# Altium project LockSafe.PrjPcb (part 2 of 2)

## Sheet 6V Boost - High Current.SchDoc
size 431 x 279 mm
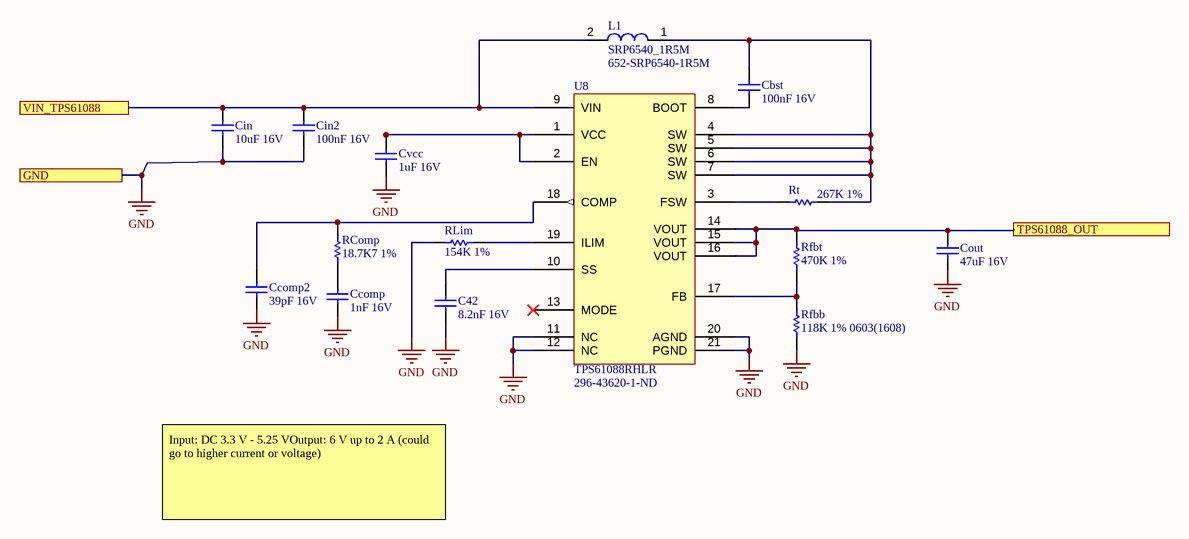
[diagram p10: 6V Boost - High Current.SchDoc]

### Parts
(Parts that share a designator on the sheet are numbered #1, #2 ... from top to bottom, then left to right.)
C42  8.2nF 16V  [CAPC0603(1608)100_M]
Cbst  100nF 16V  [CAPC0603(1608)100_N]
Ccomp  1nF 16V  [CAPC0603(1608)100_L]
Ccomp2  39pF 16V  [CAPC0603(1608)100_L]
Cin2  100nF 16V  [CAPC0603(1608)100_N]
Cin#1  10uF 16V  [CAPC0805(2012)145_N]
Cout#1  47uF 16V  [CAPC2220(5750)300_N]
Cvcc  1uF 16V  [CAPC0603(1608)100_N]
L1#2  SRP6540_1R5M  Supplier Part Number 1: 652-SRP6540-1R5M  [SRP6540_1R5M]
RComp  18.7K7 1%  [RESC0603(1608)_L]
Rfbb  118K 1% 0603(1608)  [RESC0603(1608)_M]
Rfbt  470K 1%  [RESC0603(1608)_L]
RLim  154K 1%  [RESC0603(1608)_L]
Rt  267K 1%  [RESC0603(1608)_L]
U8  TPS61088RHLR  Supplier Part Number 1: 296-43620-1-ND  [QFN50P450X350X100_HS-21N]

### Ports
GND, TPS61088_OUT, VIN_TPS61088

### Nets
GND: C42.1 Ccomp.1 Ccomp2.1 Cin2.1 Cin#1.1 Cout#1.2 Cvcc.1 Rfbb.1 RLim.1 U8.11(NC) U8.12(NC) U8.20(AGND) U8.21(PGND) ; port GND
TPS61088_OUT: Cout#1.1 Rfbt.2 U8.14(VOUT) U8.15(VOUT) U8.16(VOUT) ; port TPS61088_OUT
VIN_TPS61088: Cin2.2 Cin#1.2 L1#2.2 U8.9(VIN) ; port VIN_TPS61088
NetC42_2: C42.2 U8.10(SS)
NetCbst_1: Cbst.1 U8.8(BOOT)
NetCbst_2: Cbst.2 L1#2.1 Rt.1 U8.4(SW) U8.5(SW) U8.6(SW) U8.7(SW)
NetCcomp2_2: Ccomp2.2 RComp.2 U8.18(COMP)
NetCcomp_2: Ccomp.2 RComp.1
NetCvcc_2: Cvcc.2 U8.1(VCC) U8.2(EN)
NetRfbb_2: Rfbb.2 Rfbt.1 U8.17(FB)
NetRLim_2: RLim.2 U8.19(ILIM)
NetRt_2: Rt.2 U8.3(FSW)

Not connected (* = marked no-connect by the designer): U8 13(MODE)*

### Notes on the sheet
- Input: DC 3.3 V - 5.25 VOutput: 6 V up to 2 A (could go to higher current or voltage)
- DWG. NO.
- REV.
- SHT.
- THIS DOCUMENT AND THE DATA DISCLOSED HEREIN OR HEREWITH IS THE PROPERTY OF ALTIUM LIMITED AND MAY BE FREELY DISTRIBUTED IN WHOLE. NO RIGHTS ARE RESERVED OR EXPRESS OR IMPLIED WARANTEE GIVEN.
- REVISION
- DESCRIPTION
- DATE
- APPROVED
- ENG:
- APPROVALS
- PROJECT
- DSN:
- CHK:
- REFERENCE DOCUMENTS
- PROJECT REVISION:
- TITLE
- DOCUMENT REVISION:
- DESIGN ITEM:
- BOM:
- FAB DWG:
- PCB DWG:
- ASSY DWG:
- SCALE:
- SIZE
- B
- CAGE CODE
- FILE NAME
- DWG NO.
- SHEET
- OF
- REV

### Library data of the parts
C42 = CMP-1035-02284-1: CAP 8.2nF 16V ±5% 0603 (1608 Metric) Thickness 1mm SMD; Case-Metric: 1608; Tolerance: Â±5%; Case-EIA: 0603; Rated Voltage: 16 V; Max Thickness: 1 mm; Value: 8.2nF; Technology: SMT
Cbst Cin2 = CMP-1035-02584-1: CAP 100nF 16V ±10% 0603 (1608 Metric) Thickness 1mm SMD; Tolerance: Â±10%; Case-EIA: 0603; Case-Metric: 1608; Technology: SMT; Max Thickness: 1 mm; Value: 100nF; Rated Voltage: 16 V
Ccomp = CMP-1035-01876-1: CAP 1nF 16V ±1% 0603 (1608 Metric) Thickness 1mm SMD; Case-EIA: 0603; Case-Metric: 1608; Tolerance: Â±1%; Value: 1nF; Technology: SMT; Rated Voltage: 16 V; Max Thickness: 1 mm
Ccomp2 = CMP-1035-01085-1: CAP 51pF 16V ±5% 0603 (1608 Metric) Thickness 1mm SMD; Tolerance: Â±5%; Case-EIA: 0603; Case-Metric: 1608; Rated Voltage: 16 V; Value: 51pF; Technology: SMT; Max Thickness: 1 mm
Cin#1 = CMP-1036-04927-1: CAP 10uF 16V ±10% 0805 (2012 Metric) Thickness 1.45mm SMD; Case-EIA: 0805; Tolerance: Â±10%; Case-Metric: 2012; Rated Voltage: 16 V; Technology: SMT; Value: 10uF; Max Thickness: 1.45 mm
Cout#1 = CMP-1042-00776-1: CAP 22uF 16V ±20% 2220 (5750 Metric) Thickness 3mm SMD; Case-Metric: 5750; Case-EIA: 2220; Tolerance: Â±20%; Max Thickness: 3 mm; Value: 22uF; Rated Voltage: 16 V; Technology: SMT
Cvcc = CMP-1035-02736-1: CAP 1uF 16V ±5% 0603 (1608 Metric) Thickness 1mm SMD; Case-Metric: 1608; Case-EIA: 0603; Tolerance: Â±5%; Technology: SMT; Max Thickness: 1 mm; Rated Voltage: 16 V; Value: 1uF
L1#2 = CMP-00369-1: 1.5µH Shielded Wirewound Inductor 11A 10 mOhm Max Nonstandard; Manufacturer: Bourns; Manufacturer Part Number: SRP6540-1R5M; SVHC: No SVHC (16-Dec-2013); Product Range: BOURNS - SRP6540 Series; Inductance Tolerance: ± 20%; DC Resistance Max: 0.01ohm; Supplier 1: Mouser; Stock 1: 1156; Pricing 1: 1=1.18, 10=1.04, 50=0.888, 100=0.843, 1000=0.68, 10000=0.492 (USD); Saturation Current (Isat): 11A; Case Dimensions: 7.2mm x 6.5mm x 4mm; Inductance: 1.5µH; Inductor Construction: Shielded; RMS Current (Irms): 11A; Packaging: Each; ComponentLink1URL: https://datasheet.ciiva.com/15027/srp6540-15027285.pdf; ComponentLink1Description: https://datasheet.ciiva.com/15027/srp6540-15027285.pdf; ComponentLink2URL: https://datasheet.ciiva.com/15027/srp6540-15027286.pdf; ComponentLink2Description: https://datasheet.ciiva.com/15027/srp6540-15027286.pdf; ComponentLink3URL: https://datasheet.ciiva.com/15027/srp6540-15027287.pdf; ComponentLink3Description: https://datasheet.ciiva.com/15027/srp6540-15027287.pdf; ComponentLink4URL: https://datasheet.ciiva.com/22667/1698468-22667146.pdf; ComponentLink4Description: https://datasheet.ciiva.com/22667/1698468-22667146.pdf; ComponentLink5URL: https://datasheet.ciiva.com/17000/70281705-17000734.pdf; ComponentLink5Description: https://datasheet.ciiva.com/17000/70281705-17000734.pdf; ComponentLink6URL: https://datasheet.ciiva.com/28679/1698468-28679550.pdf; ComponentLink6Description: https://datasheet.ciiva.com/28679/1698468-28679550.pdf; SchLibComponentName: SRP6540_1R5M
RComp = CMP-1012-00673-1: 28K7 0.1W 1% 0603 (1608 Metric)  SMD; Case-EIA: 0603; Case-Metric: 1608; Value: 28700.00 Ohm; Tolerance: 1 %; Power: 0.1 W; Technology: SMT
Rfbb = CMP-1012-00743-1: 118K 0.1W 1% 0603 (1608 Metric)  SMD; Case-Metric: 1608; Case-EIA: 0603; Value: 118000.00 Ohm; Technology: SMT; Power: 0.1 W; Tolerance: 1 %
Rfbt = CMP-1012-00812-1: 470K 0.1W 1% 0603 (1608 Metric)  SMD; Value: 470000.00 Ohm; Case-EIA: 0603; Case-Metric: 1608; Power: 0.1 W; Tolerance: 1 %; Technology: SMT
RLim = CMP-1012-00738-1: 105K 0.1W 1% 0603 (1608 Metric)  SMD; Value: 105000.00 Ohm; Case-Metric: 1608; Case-EIA: 0603; Tolerance: 1 %; Technology: SMT; Power: 0.1 W
Rt = CMP-1012-00782-1: 267K 0.1W 1% 0603 (1608 Metric)  SMD; Case-Metric: 1608; Case-EIA: 0603; Value: 267000.00 Ohm; Tolerance: 1 %; Technology: SMT; Power: 0.1 W
U8 = CMP-00368-3: Manufacturer: Texas Instruments; Function: Step-Up; Output Configuration: Positive; Topology: Boost; Output Type: Adjustable; Number of Outputs: 1; Voltage - Input (Min): 2.7V; Voltage - Input (Max): 12V; Voltage - Output (Min/Fixed): 4.5V; Voltage - Output (Max): 12.6V; Current - Output: 10A; Frequency - Switching: 200kHz ~ 2.2MHz; Synchronous Rectifier: Yes; SchLibComponentName: Component_1; Supplier 1: Digi-Key; Manufacturer Part Number: TPS61088RHLR; RoHS: RoHS Compliant; Category: Integrated Circuits (ICs); Stock 1: 3052; Pricing 1: 1=3.93, 10=3.53, 100=2.8922, 500=2.46212, 1000=2.07648 (USD); Packaging: Cut Tape (CT); Part Status: Active; Operating Temperature: -40°C ~ 85°C (TA); Mounting Type: Surface Mount; Package / Case: 20-VFQFN Exposed Pad; Supplier Device Package: 20-VQFN (3.5x4.5); ComponentLink1URL: http://www.ti.com/lit/ds/symlink/tps61088.pdf; ComponentLink1Description: http://www.ti.com/lit/ds/symlink/tps61088.pdf

## Sheet Microphone.SchDoc
size A
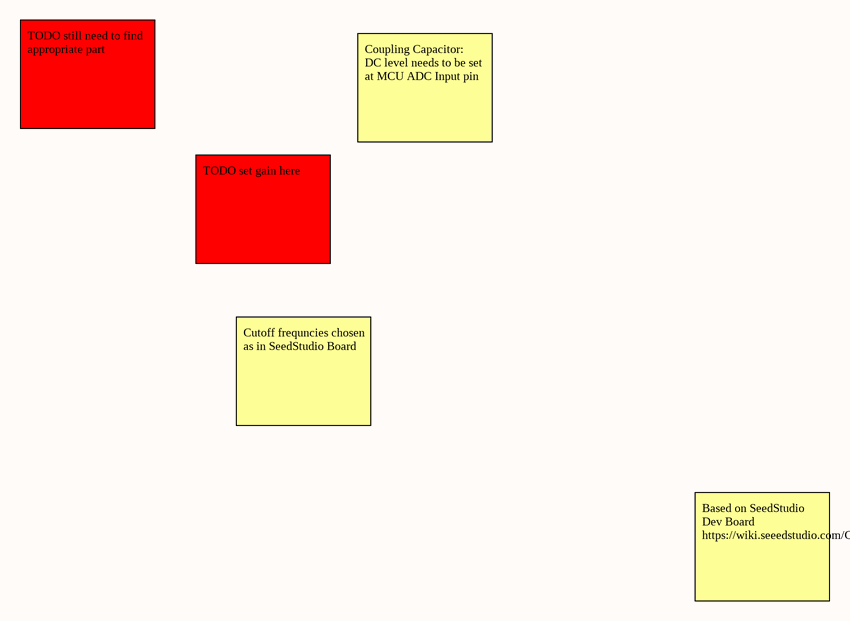
[diagram p11: Microphone.SchDoc]

### Notes on the sheet
- TODO still need to find appropriate part
- Coupling Capacitor:
  DC level needs to be set at MCU ADC Input pin
- TODO set gain here
- Cutoff frequncies chosen as in SeedStudio Board
- Based on SeedStudio Dev Board https://wiki.seeedstudio.com/Grove-Analog-Microphone/

## Sheet Buck6Vto3.3V.SchDoc
size A
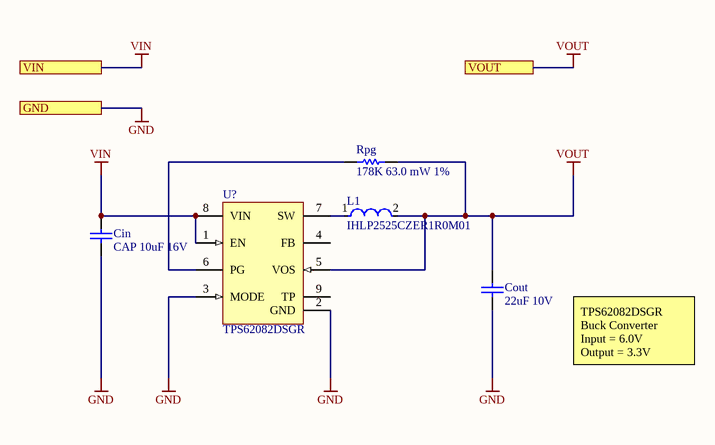
[diagram p12: Buck6Vto3.3V.SchDoc]

### Parts
(Parts that share a designator on the sheet are numbered #1, #2 ... from top to bottom, then left to right.)
Cin#2  CAP 10uF 16V  [CAPC0805(2012)145_N]
Cout#2  22uF 10V  [CAPC0805(2012)145_N]
L1#3  IHLP2525CZER1R0M01  [FP-IHLP-2525CZ-FP_2_413x3-MFG]
Rpg  178K 63.0 mW 1%  [RESC0603(1608)_N]
U?  TPS62082DSGR  [DSG8-1600X900TP]

### Ports
GND, VIN, VOUT

### Nets
GND: Cin#2.1 Cout#2.1 U?.2(GND) U?.3(MODE) ; port GND
VIN: Cin#2.2 U?.1(EN) U?.8(VIN) ; port VIN
VOUT: Cout#2.2 L1#3.2 Rpg.2 U?.5(VOS) ; port VOUT
NetL1#3_1: L1#3.1 U?.7(SW)
NetRpg_1: Rpg.1 U?.6(PG)

Not connected (* = marked no-connect by the designer): U? 4(FB) 9(TP)

### Notes on the sheet
- TPS62082DSGR
  Buck Converter
  Input = 6.0V
  Output = 3.3V

### Library data of the parts
Cin#2 = CMP-1036-04927-1: CAP 10uF 16V ±10% 0805 (2012 Metric) Thickness 1.45mm SMD; Manufacturer: Kyocera AVX; Manufacturer Part Number: 0805YD106KAT2A; Manufacturer: KEMET; Manufacturer Part Number: C0805C106K4PACTU; Manufacturer: TDK; Manufacturer Part Number: C2012X5R1C106K/0.85; Manufacturer Part Number: C2012X6S1C106K; Manufacturer Part Number: C0805C106K4PAC; Manufacturer Part Number: 0805YD106KAT4A; Manufacturer Part Number: C2012X5R1C106K/1.25; Case-EIA: 0805; Tolerance: Â±10%; Case-Metric: 2012; Rated Voltage: 16 V; Technology: SMT; Value: 10uF; Max Thickness: 1.45 mm
Cout#2 = CMP-1036-04943-1: CAP 22uF 10V ±20% 0805 (2012 Metric) Thickness 1.45mm SMD; Manufacturer: TDK; Manufacturer Part Number: C2012X5R1A226M/0.85; Manufacturer Part Number: C2012X5R1A226M/1.25; Manufacturer Part Number: C2012X6S1A226M; Case-Metric: 2012; Case-EIA: 0805; Tolerance: Â±20%; Rated Voltage: 10 V; Max Thickness: 1.45 mm; Technology: SMT; Value: 22uF
L1#3 = CMP-02424-000599-1: Commercial Inductors, High Saturation Series 1uH 11A 10mΩ 20%; Self Resonant Frequency: 5MHz; Test Frequency: 100kHz; Shielding: Shielded; Core Material: Metal; Saturation Current: 22A; DC Resistance (DCR): 10mR; Current Rating: 11A; Packaging: Tape and Reel; Width: 6.47mm; Number of Pins: 2; Case/Package: 2525; Termination: SMD/SMT; Length: 7.24mm; Height: 3mm; Min Operating Temperature: -55°C; Mount: Surface Mount; Inductance Tolerance: 20%; Max Operating Temperature: 125°C; Military Standard: Not; Max DC Current: 11A; RMS Current (Irms): 11A; Lead Free: Lead Free; Depth: 6.72mm; Tolerance: 20%; Package Quantity: 2000; Radiation Hardening: No; Contact Plating: Tin; Inductance: 1uH
Rpg = CMP-1012-00756-1: 178K  1% 0603 (1608 Metric)  SMD; Manufacturer: Panasonic; Manufacturer Part Number: ERJ-3EKF1583V; Manufacturer: Bourns; Manufacturer Part Number: CR0603-FX-1583ELF; Manufacturer: Vishay Dale; Manufacturer Part Number: CRCW0603158KFKEB; Manufacturer: Yageo; Manufacturer Part Number: RC0603FR-07158KL; Manufacturer: Vishay; Manufacturer Part Number: CRCW0603158KFKEA; Manufacturer Part Number: CRCW0603158KFKTA; Power: 0.1 W; Value: 158000.00 Ohm; Case-Metric: 1608; Case-EIA: 0603; Tolerance: 1 %; Technology: SMT
U? = CMP-0323-00344-2: Buck Step Down Regulator with 2.3 to 6 V Input and 3.3 V Output, -40 to 85 degC, 8-Pin WSON (DSG), Green (RoHS & no Sb/Br); Manufacturer: Texas Instruments; Duty Cycle(Max)(%): 100; Iq(Typ)(mA): 0.006; Rating: Catalog; Regulated Outputs(#): 1; Vout(Min)(V): 3.3; SubFamily: Step-Down Regulator; Vin(Max)(V): 6; Iout(Max)(A): 1.2; Vin(Min)(V): 2.3; Switch Current Limit(Typ)(A): 2.4; ComponentLink1Description: Datasheet; PackageReference: DSG8-1600X900TP; ComponentLink2Description: Package Specification; PackageDescription: 8-Pin Plastic Small Outline No-Lead, 2 x 2 x 0.8 mm Body, 0.5 mm Pitch, Exposed Pad; DatasheetVersion: SLVSAE8B; PackageVersion: revB, Oct-2010; Eco-Plan: Green (RoHS & no Sb/Br); Code_JEDEC: MO-229; PartNumber: TPS62082DSGR; ComponentLink1URL: http://www.ti.com/general/docs/lit/getliterature.tsp?genericPartNumber=TPS62082&fileType=pdf; ComponentLink2URL: http://www.ti.com/litv/pdf/mpds308a; ComponentLink3URL: Samples URL:http://www.ti.com/product/tps62082#samples; Mounting Technology: Surface Mount; Vout(Max)(V): 3.3; ComponentLink3Description: URL Link1; Topology: Buck

## Sheet LEDdriver3954.SchDoc
size A
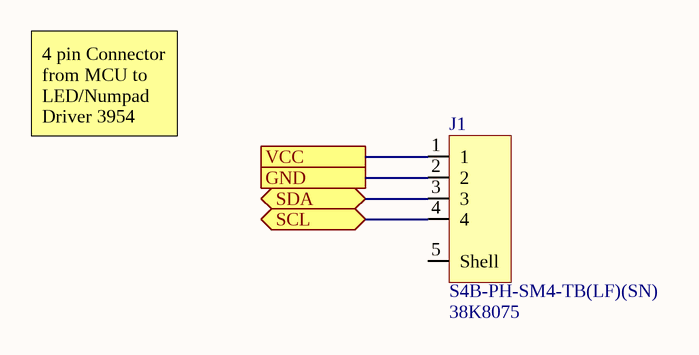
[diagram p13: LEDdriver3954.SchDoc]

### Parts
(Parts that share a designator on the sheet are numbered #1, #2 ... from top to bottom, then left to right.)
J1#2  S4B-PH-SM4-TB(LF)(SN)  Supplier Part Number 1: 38K8075  [S4B-PH-SM4-TB(LF)(SN)]

### Ports
GND, SCL (bidir), SDA (bidir), VCC

### Nets
GND: J1#2.2 ; port GND
SCL: J1#2.4 ; port SCL
SDA: J1#2.3 ; port SDA
VCC: J1#2.1 ; port VCC

Not connected (* = marked no-connect by the designer): J1#2 5(Shell)

### Notes on the sheet
- 4 pin Connector from MCU to LED/Numpad Driver 3954

### Library data of the parts
J1#2 = S4B-PH-SM4-TB(LF)(SN): JST (JAPAN SOLDERLESS TERMINALS) - S4B-PH-SM4-TB(LF)(SN) - Wire-To-Board Connector, 2 mm, 4 Contacts, Header, PH Series, Surface Mount, 1 Rows; Number of Positions: 4; Insulation Resistance: 1GR; Gender: Male; Current Rating: 2A; Voltage Rating: 100V; Connector Type: Header,Male Pin; Contact Resistance: 20mR; Pitch: 2mm; Supplier 1: Newark; Manufacturer: JST; Manufacturer Part Number: S4B-PH-SM4-TB(LF)(SN); RoHS: Yes; Category: Connectors; Mount: Surface Mount; Housing Material: Polyamide; Color: Natural,White; Contact Material: Copper Alloy,Tin,Bronze,Brass; Contact Plating: Tin,Copper; Housing Color: Beige; Contact Shape: Square; Insulation Material: Nylon; Insulation Color: Natural; Min Operating Temperature: -25°C; Max Operating Temperature: 85°C; Termination: Solder; Number of Contacts: 4; Number of Rows: 1; Packaging: Tape and Reel; Voltage Rating (AC): 100V; Orientation: Right Angle; Fastening Type: Detent; Working Voltage: 100V; Max Voltage Rating (AC): 100V; Max Voltage Rating (DC): 100V; Number of Poles: 4; Max Current Rating: 2A; Length: 11.9mm; Width: 5mm; Height: 9.4mm; Contact Mating Length: 0.13inch; Depth: 7.6mm; Lead Pitch: 2mm; Lead Free: Lead Free; REACH SVHC: No SVHC; Flammability Rating: UL94 V-0; ComponentLink1URL: https://datasheet.ciiva.com/11746/0900766b80df0d9d-11746552.pdf?src-supplier=RSComponents; ComponentLink1Description: https://datasheet.ciiva.com/11746/0900766b80df0d9d-11746552.pdf?src-supplier=RSComponents; ComponentLink2URL: https://datasheet.ciiva.com/712/eph-712578.pdf?src-supplier=Digi-Key; ComponentLink2Description: https://datasheet.ciiva.com/712/eph-712578.pdf?src-supplier=Digi-Key; ComponentLink3URL: https://datasheet.ciiva.com/712/eph-712579.pdf?src-supplier=Digi-Key; ComponentLink3Description: https://datasheet.ciiva.com/712/eph-712579.pdf?src-supplier=Digi-Key; ComponentLink4URL: https://datasheet.ciiva.com/730/eph-730675.pdf?src-supplier=Digi-Key; ComponentLink4Description: https://datasheet.ciiva.com/730/eph-730675.pdf?src-supplier=Digi-Key; ComponentLink5URL: https://datasheet.ciiva.com/8052/1699381-8052234.pdf?src-supplier=Element14; ComponentLink5Description: https://datasheet.ciiva.com/8052/1699381-8052234.pdf?src-supplier=Element14; ComponentLink6URL: https://datasheet.ciiva.com/26894/getdatasheetpartid-639990-26894620.pdf?src-supplier=Verical; ComponentLink6Description: https://datasheet.ciiva.com/26894/getdatasheetpartid-639990-26894620.pdf?src-supplier=Verical; ComponentLink7URL: https://datasheet.ciiva.com/16376/eph-16376783.pdf?src-supplier=Future+Electronics; ComponentLink7Description: https://datasheet.ciiva.com/16376/eph-16376783.pdf?src-supplier=Future+Electronics

## Nets that join several sheets
3V3: MAIN (6 pins), MCU (7 pins), Speaker (R35.1), Temperature (R41.1 TP27.1), Accelerometer (R40.1 TP26.1 U10.4 U10.5), Light (R42.1 TP34.1)
6V: MAIN (R22.2), Servo (R39.1)
6V_out: MAIN (R22.1), 6v_BOOST (C20.2 C21.2 D2.2 R15.2)
GND: MAIN (11 pins), MCU (19 pins), 6v_BOOST (12 pins), Speaker (6 pins), Servo (P7.1 TP25.1), Temperature (C51.1 R47.1 U11.4), Accelerometer (5 pins), Light (C52.1 U12.1 U12.4)
VOUT: MAIN (C8.2 R23.2), 6v_BOOST (8 pins)
GPIO1: MCU (U4.14), Temperature (R47.2 TP33.1 U11.5)
I2C_0_SCL: MAIN (R45.1 TP29.1), MCU (U4.39)
I2C_0_SDA: MAIN (R46.1 TP28.1), MCU (U4.38)
I2C_1_SCL: MAIN (R43.1 TP32.1), MCU (U4.9), Temperature (U11.2), Accelerometer (U10.2), Light (U12.5)
I2C_1_SDA: MAIN (R44.1 TP31.1), MCU (U4.15), Temperature (U11.3), Accelerometer (U10.3), Light (U12.2)
INTRP0: MCU (U4.27), Accelerometer (TP30.1 U10.6)
INTRP1: MCU (U4.28), Light (TP37.1 U12.3)
MCU_LED: MAIN (DS1.2), MCU (U4.16)
MCU_RX_UART_CLI: MAIN (TP4.1), MCU (U4.44)
MCU_TX_UART_CLI: MAIN (TP2.1), MCU (U4.43)
SERCOM1_PAD2_SPI_MISO: MAIN (R9.1), MCU (U4.8)
SERCOM1_PAD2_SPI_MOSI: MAIN (R8.1), MCU (U4.11)
SERCOM1_PAD3_SPI_SCK: MAIN (R10.1), MCU (U4.12)
SERVO_CTRL: MCU (U4.40), Servo (P7.3 TP24.1)
SPKR_EN: MCU (U4.13), Speaker (R38.2 U9.1)
SPKR_SIG: MCU (U4.31), Speaker (C43.2)

## Assembly variants
Build_Alt: not fitted FD1 FD2 FD3 TP1 TP2 TP3 TP4 TP5 TP6 TP7 TP8 TP9 TP10 TP11